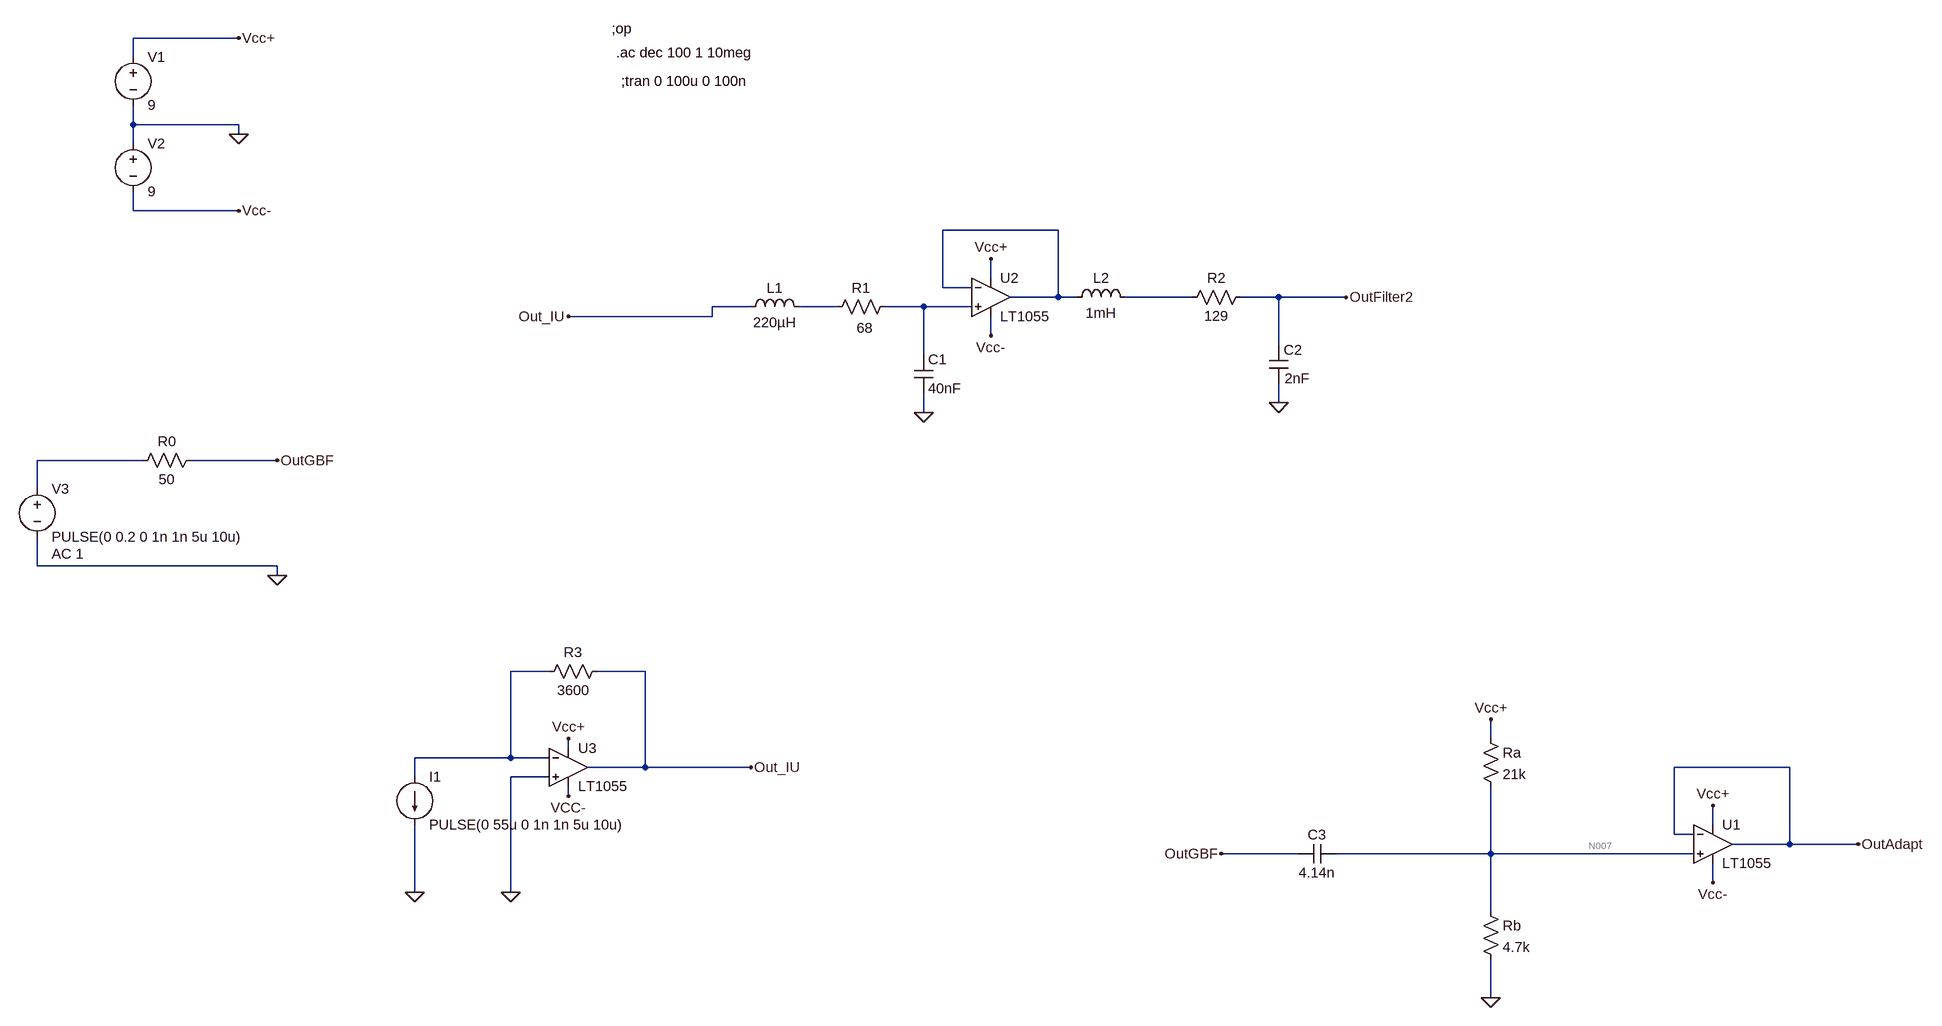
[diagram p0: schematic Draft1.asc]
Draft1.asc, the LTspice schematic file:
Version 4
SHEET 1 3360 1616
WIRE 208 -416 32 -416
WIRE 32 -384 32 -416
WIRE 32 -272 32 -304
WIRE 208 -272 32 -272
WIRE 208 -256 208 -272
WIRE 32 -240 32 -272
WIRE 32 -128 32 -160
WIRE 208 -128 32 -128
WIRE 1760 -96 1568 -96
WIRE 1648 -16 1648 -48
WIRE 1568 0 1568 -96
WIRE 1616 0 1568 0
WIRE 1760 16 1760 -96
WIRE 1760 16 1680 16
WIRE 1792 16 1760 16
WIRE 1984 16 1872 16
WIRE 2128 16 2064 16
WIRE 2240 16 2128 16
WIRE 1248 32 1184 32
WIRE 1392 32 1328 32
WIRE 1536 32 1472 32
WIRE 1616 32 1536 32
WIRE 1184 48 1184 32
WIRE 1184 48 944 48
WIRE 1648 80 1648 48
WIRE 2128 96 2128 16
WIRE 1536 112 1536 32
WIRE 2128 192 2128 160
WIRE 1536 208 1536 176
WIRE 48 288 -128 288
WIRE 272 288 128 288
WIRE -128 336 -128 288
WIRE -128 464 -128 416
WIRE 272 464 -128 464
WIRE 272 480 272 464
WIRE 912 720 848 720
WIRE 1072 720 992 720
WIRE 2528 832 2528 800
WIRE 944 848 944 832
WIRE 848 864 848 720
WIRE 848 864 688 864
WIRE 912 864 848 864
WIRE 1072 880 1072 720
WIRE 1072 880 976 880
WIRE 1248 880 1072 880
WIRE 3056 880 2864 880
WIRE 688 896 688 864
WIRE 912 896 848 896
WIRE 944 928 944 912
WIRE 2928 976 2928 944
WIRE 2864 992 2864 880
WIRE 2896 992 2864 992
WIRE 3056 1008 3056 880
WIRE 3056 1008 2960 1008
WIRE 3232 1008 3056 1008
WIRE 2160 1024 2032 1024
WIRE 2528 1024 2528 912
WIRE 2528 1024 2224 1024
WIRE 2896 1024 2528 1024
WIRE 2928 1072 2928 1040
WIRE 688 1088 688 976
WIRE 848 1088 848 896
WIRE 2528 1120 2528 1024
WIRE 2528 1264 2528 1200
FLAG 208 -128 Vcc-
FLAG 208 -416 Vcc+
FLAG 272 288 OutGBF
FLAG 1536 208 0
FLAG 2128 192 0
FLAG 944 48 Out_IU
FLAG 2240 16 OutFilter2
FLAG 1648 80 Vcc-
FLAG 1648 -48 Vcc+
FLAG 208 -256 0
FLAG 272 480 0
FLAG 688 1088 0
FLAG 848 1088 0
FLAG 1248 880 Out_IU
FLAG 944 832 Vcc+
FLAG 944 928 VCC-
FLAG 2528 1264 0
FLAG 2928 944 Vcc+
FLAG 2928 1072 Vcc-
FLAG 3232 1008 OutAdapt
FLAG 2032 1024 OutGBF
FLAG 2528 800 Vcc+
SYMBOL res 144 272 R90
WINDOW 0 0 56 VBottom 2
WINDOW 3 32 56 VTop 2
SYMATTR InstName R0
SYMATTR Value 50
SYMBOL Opamps\\LT1055 1648 -48 R0
SYMATTR InstName U2
SYMBOL cap 1520 112 R0
SYMATTR InstName C1
SYMATTR Value 40nF
SYMBOL cap 2112 96 R0
WINDOW 3 26 56 Left 2
SYMATTR Value 2nF
SYMATTR InstName C2
SYMBOL res 2080 0 R90
WINDOW 0 0 56 VBottom 2
WINDOW 3 32 56 VTop 2
SYMATTR InstName R2
SYMATTR Value 129
SYMBOL res 1488 16 R90
WINDOW 0 0 56 VBottom 2
WINDOW 3 36 50 VTop 2
SYMATTR InstName R1
SYMATTR Value 68
SYMBOL ind 1232 48 R270
WINDOW 0 32 56 VTop 2
WINDOW 3 5 56 VBottom 2
SYMATTR InstName L1
SYMATTR Value 220µH
SYMBOL ind 1776 32 R270
WINDOW 0 32 56 VTop 2
WINDOW 3 5 56 VBottom 2
SYMATTR InstName L2
SYMATTR Value 1mH
SYMBOL voltage 32 -400 R0
WINDOW 123 0 0 Left 0
WINDOW 39 0 0 Left 0
SYMATTR InstName V1
SYMATTR Value 9
SYMBOL voltage 32 -256 R0
WINDOW 123 0 0 Left 0
WINDOW 39 0 0 Left 0
SYMATTR InstName V2
SYMATTR Value 9
SYMBOL voltage -128 320 R0
WINDOW 123 24 124 Left 2
WINDOW 39 0 0 Left 0
SYMATTR Value2 AC 1
SYMATTR InstName V3
SYMATTR Value PULSE(0 0.2 0 1n 1n 5u 10u)
SYMBOL Opamps\\LT1055 944 816 R0
SYMATTR InstName U3
SYMBOL res 1008 704 R90
WINDOW 0 0 56 VBottom 2
WINDOW 3 32 56 VTop 2
SYMATTR InstName R3
SYMATTR Value 3600
SYMBOL current 688 896 R0
WINDOW 123 0 0 Left 0
WINDOW 39 0 0 Left 0
SYMATTR InstName I1
SYMATTR Value PULSE(0 55u 0 1n 1n 5u 10u)
SYMBOL cap 2224 1008 R90
WINDOW 0 0 32 VBottom 2
WINDOW 3 32 32 VTop 2
SYMATTR InstName C3
SYMATTR Value 4.14n
SYMBOL res 2512 816 R0
SYMATTR InstName Ra
SYMATTR Value 21k
SYMBOL res 2512 1104 R0
SYMATTR InstName Rb
SYMATTR Value 4.7k
SYMBOL Opamps\\LT1055 2928 944 R0
SYMATTR InstName U1
TEXT 1016 -432 Left 2 !;op
TEXT 1024 -392 Left 2 !.ac dec 100 1 10meg
TEXT 1032 -344 Left 2 !;tran 0 100u 0 100n

The netlist it stands for:
* Draft1.asc
R0 OutGBF N005 50
XU2 N004 N001 Vcc+ Vcc- N001 LT1055  ; pins In+ In- V+ V- OUT
C1 N004 0 40nF
C2 OutFilter2 0 2nF
R2 OutFilter2 N002 129
R1 N004 N003 68
L1 Out_IU N003 220µH
L2 N001 N002 1mH
V1 Vcc+ 0 9
V2 0 Vcc- 9
V3 N005 0 PULSE(0 0.2 0 1n 1n 5u 10u) AC 1
XU3 0 N006 Vcc+ Vcc- Out_IU LT1055  ; pins In+ In- V+ V- OUT
R3 Out_IU N006 3600
I1 N006 0 PULSE(0 55u 0 1n 1n 5u 10u)
C3 N007 OutGBF 4.14n
Ra Vcc+ N007 21k
Rb N007 0 4.7k
XU1 N007 OutAdapt Vcc+ Vcc- OutAdapt LT1055  ; pins In+ In- V+ V- OUT
;op
.ac dec 100 1 10meg
;tran 0 100u 0 100n
.backanno
.end

* Results of the author's LTspice run, read from the files saved beside the schematic
* Operating Point, zero values left out:
*   V(vcc+) = 9 V
*   V(vcc-) = -9 V
*   V(n007) = 1.646 V
*   V(outadapt) = 1.646 V
*   I(Rb) = 350.2 µA
*   I(Ra) = 350.2 µA
*   I(V2) = -8.4 mA
*   I(V1) = -8.75 mA
*   Ix(u2:3) = 2.8 mA
*   Ix(u2:4) = -2.8 mA
*   Ix(u3:3) = 2.8 mA
*   Ix(u3:4) = -2.8 mA
*   Ix(u1:3) = 2.8 mA
*   Ix(u1:4) = -2.8 mA
*   Ix(u1:5) = -4.115 pA
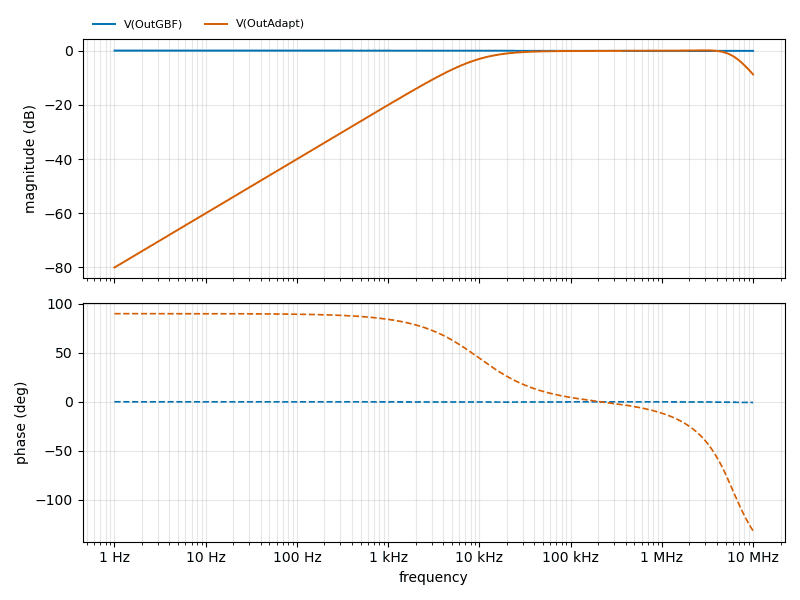
[diagram p1: AC Analysis of Draft1.asc, plotted from the saved traces]
* AC Analysis, 1 run:
*   V(OutGBF): -0.00 dB at 1 Hz, -0.11 dB at 10 MHz, peak -0.00 dB at 1 Hz
*   V(OutAdapt): -80.01 dB at 1 Hz, -8.79 dB at 10 MHz, peak 0.10 dB at 2.818 MHz, 3 dB below the peak at 10.39 kHz and 6.59 MHz